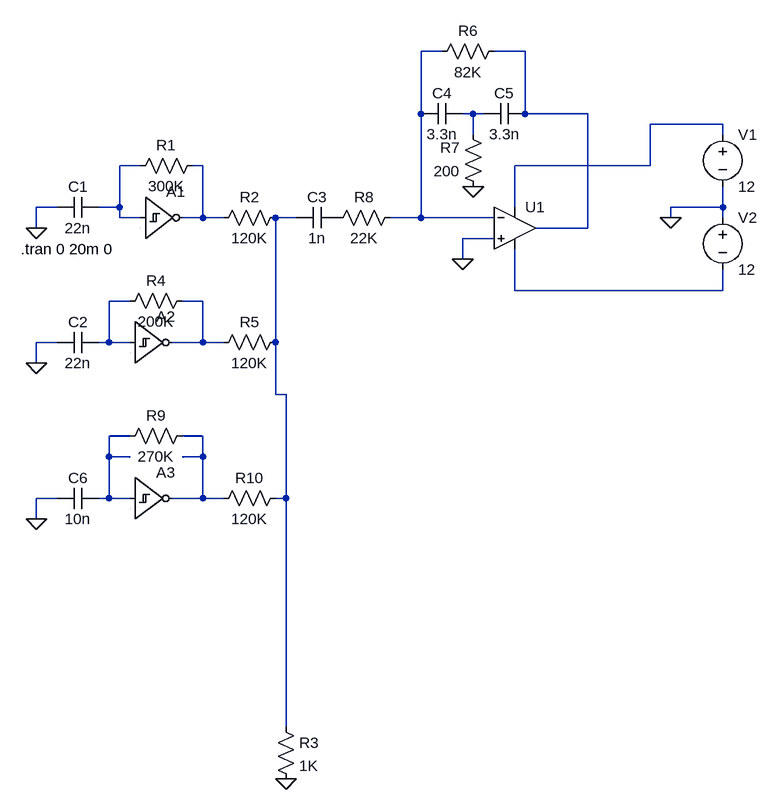
[diagram p0: schematic noise_gen 18n replacement.asc]
noise_gen 18n replacement.asc, the LTspice schematic file:
Version 4
SHEET 1 1128 964
WIRE 640 -176 608 -176
WIRE 768 -176 720 -176
WIRE 608 -80 608 -176
WIRE 688 -80 672 -80
WIRE 704 -80 688 -80
WIRE 768 -80 768 -176
WIRE 864 -80 768 -80
WIRE 1072 -64 960 -64
WIRE 688 -48 688 -80
WIRE 1072 -48 1072 -64
WIRE 176 0 144 0
WIRE 272 0 256 0
WIRE 960 0 960 -64
WIRE 960 0 752 0
WIRE 48 64 16 64
WIRE 144 64 144 0
WIRE 144 64 112 64
WIRE 752 64 752 0
WIRE 1072 64 1072 32
WIRE 1072 64 992 64
WIRE 144 80 144 64
WIRE 176 80 144 80
WIRE 272 80 272 0
WIRE 272 80 240 80
WIRE 304 80 272 80
WIRE 416 80 384 80
WIRE 608 80 608 -80
WIRE 608 80 560 80
WIRE 720 80 608 80
WIRE 992 80 992 64
WIRE 1072 80 1072 64
WIRE 16 96 16 64
WIRE 864 96 864 -80
WIRE 864 96 784 96
WIRE 720 112 672 112
WIRE 672 144 672 112
WIRE 752 192 752 128
WIRE 1072 192 1072 160
WIRE 1072 192 752 192
WIRE 160 208 128 208
WIRE 272 208 240 208
WIRE 48 272 16 272
WIRE 128 272 128 208
WIRE 128 272 112 272
WIRE 160 272 128 272
WIRE 272 272 272 208
WIRE 272 272 224 272
WIRE 304 272 272 272
WIRE 384 272 384 80
WIRE 16 304 16 272
WIRE 384 352 384 272
WIRE 400 352 384 352
WIRE 160 416 128 416
WIRE 272 416 240 416
WIRE 128 448 128 416
WIRE 160 448 128 448
WIRE 272 448 272 416
WIRE 272 448 240 448
WIRE 48 512 16 512
WIRE 128 512 128 448
WIRE 128 512 112 512
WIRE 160 512 128 512
WIRE 272 512 272 448
WIRE 272 512 224 512
WIRE 304 512 272 512
WIRE 400 512 400 352
WIRE 400 512 384 512
WIRE 16 544 16 512
WIRE 400 864 400 512
FLAG 16 96 0
FLAG 400 944 0
FLAG 16 304 0
FLAG 672 144 0
FLAG 688 32 0
FLAG 992 80 0
FLAG 16 544 0
SYMBOL cap 112 48 R90
WINDOW 0 0 32 VBottom 2
WINDOW 3 32 32 VTop 2
SYMATTR InstName C1
SYMATTR Value 22n
SYMBOL res 272 -16 R90
WINDOW 0 0 56 VBottom 2
WINDOW 3 32 56 VTop 2
SYMATTR InstName R1
SYMATTR Value 300K
SYMBOL Digital\\schmtinv 176 16 R0
WINDOW 3 0 0 Invisible 0
SYMATTR Value Vhigh=9 Vt=4.45 Vh=.85 Trise=.1u Tfall=.1u
SYMATTR InstName A1
SYMBOL res 400 64 R90
WINDOW 0 0 56 VBottom 2
WINDOW 3 32 56 VTop 2
SYMATTR InstName R2
SYMATTR Value 120K
SYMBOL res 384 848 R0
SYMATTR InstName R3
SYMATTR Value 1K
SYMBOL cap 112 256 R90
WINDOW 0 0 32 VBottom 2
WINDOW 3 32 32 VTop 2
SYMATTR InstName C2
SYMATTR Value 22n
SYMBOL res 256 192 R90
WINDOW 0 0 56 VBottom 2
WINDOW 3 32 56 VTop 2
SYMATTR InstName R4
SYMATTR Value 200K
SYMBOL res 400 256 R90
WINDOW 0 0 56 VBottom 2
WINDOW 3 32 56 VTop 2
SYMATTR InstName R5
SYMATTR Value 120K
SYMBOL Digital\\schmtinv 160 208 R0
WINDOW 3 8 60 Invisible 2
SYMATTR Value Vhigh=9 Vt=4.45 Vh=.85 Trise=.1u Tfall=.1u
SYMATTR InstName A2
SYMBOL cap 480 64 R90
WINDOW 0 0 32 VBottom 2
WINDOW 3 32 32 VTop 2
SYMATTR InstName C3
SYMATTR Value 1n
SYMBOL cap 672 -96 R90
WINDOW 0 0 32 VBottom 2
WINDOW 3 32 32 VTop 2
SYMATTR InstName C4
SYMATTR Value 3.3n
SYMBOL cap 768 -96 R90
WINDOW 0 0 32 VBottom 2
WINDOW 3 32 32 VTop 2
SYMATTR InstName C5
SYMATTR Value 3.3n
SYMBOL res 736 -192 R90
WINDOW 0 0 56 VBottom 2
WINDOW 3 32 56 VTop 2
SYMATTR InstName R6
SYMATTR Value 82K
SYMBOL res 704 48 R180
WINDOW 0 36 76 Left 2
WINDOW 3 36 40 Left 2
SYMATTR InstName R7
SYMATTR Value 200
SYMBOL res 464 96 R270
WINDOW 0 32 56 VTop 2
WINDOW 3 0 56 VBottom 2
SYMATTR InstName R8
SYMATTR Value 22K
SYMBOL OpAmps\\UniversalOpamp2 752 96 R0
SYMATTR InstName U1
SYMBOL voltage 1072 -64 R0
WINDOW 123 0 0 Left 0
WINDOW 39 0 0 Left 0
SYMATTR InstName V1
SYMATTR Value 12
SYMBOL voltage 1072 64 R0
WINDOW 123 0 0 Left 0
WINDOW 39 0 0 Left 0
SYMATTR InstName V2
SYMATTR Value 12
SYMBOL cap 112 496 R90
WINDOW 0 0 32 VBottom 2
WINDOW 3 32 32 VTop 2
SYMATTR InstName C6
SYMATTR Value 10n
SYMBOL res 256 400 R90
WINDOW 0 0 56 VBottom 2
WINDOW 3 32 56 VTop 2
SYMATTR InstName R9
SYMATTR Value 270K
SYMBOL Digital\\schmtinv 160 448 R0
WINDOW 3 8 60 Invisible 2
SYMATTR Value Vhigh=9 Vt=4.45 Vh=.85 Trise=.1u Tfall=.1u
SYMATTR InstName A3
SYMBOL res 400 496 R90
WINDOW 0 0 56 VBottom 2
WINDOW 3 32 56 VTop 2
SYMATTR InstName R10
SYMATTR Value 120K
TEXT -8 128 Left 2 !.tran 0 20m 0

The netlist it stands for:
* noise_gen 18n replacement.asc
C1 N005 0 22n
R1 N006 N005 300K
A1 N005 0 0 0 0 N006 0 0 SCHMITT Vhigh=9 Vt=4.45 Vh=.85 Trise=.1u Tfall=.1u
R2 N007 N006 120K
R3 N007 0 1K
C2 N009 0 22n
R4 N010 N009 200K
R5 N007 N010 120K
A2 N009 0 0 0 0 N010 0 0 SCHMITT Vhigh=9 Vt=4.45 Vh=.85 Trise=.1u Tfall=.1u
C3 P001 N007 1n
C4 N003 N001 3.3n
C5 N002 N003 3.3n
R6 N002 N001 82K
R7 0 N003 200
R8 P001 N001 22K
XU1 0 N001 N004 N008 N002 level.2 Avol=1Meg GBW=10Meg Slew=10Meg ilimit=25m rail=0 Vos=0 phimargin=45 en=0 enk=0 in=0 ink=0 Rin=500Meg  ; pins IN+ IN- V+ V- OUT
V1 N004 0 12
V2 0 N008 12
C6 N011 0 10n
R9 N012 N011 270K
A3 N011 0 0 0 0 N012 0 0 SCHMITT Vhigh=9 Vt=4.45 Vh=.85 Trise=.1u Tfall=.1u
R10 N007 N012 120K
.tran 0 20m 0
.lib UniversalOpamps2.sub
.backanno
.end